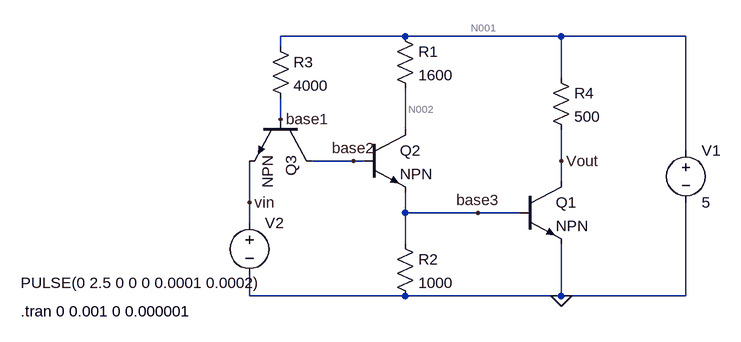
[diagram p0: schematic TTL_NAND_gate.asc]
TTL_NAND_gate.asc, the LTspice schematic file:
Version 4
SHEET 1 880 680
WIRE -736 -528 -928 -528
WIRE -496 -528 -736 -528
WIRE -304 -528 -496 -528
WIRE -928 -512 -928 -528
WIRE -496 -464 -496 -528
WIRE -928 -400 -928 -432
WIRE -736 -384 -736 -448
WIRE -304 -352 -304 -528
WIRE -816 -336 -880 -336
WIRE -800 -336 -816 -336
WIRE -496 -336 -496 -384
WIRE -496 -304 -496 -336
WIRE -976 -272 -976 -336
WIRE -736 -256 -736 -288
WIRE -624 -256 -736 -256
WIRE -560 -256 -624 -256
WIRE -976 -240 -976 -272
WIRE -736 -208 -736 -256
WIRE -976 -128 -976 -160
WIRE -736 -128 -976 -128
WIRE -496 -128 -496 -208
WIRE -496 -128 -736 -128
WIRE -304 -128 -304 -272
WIRE -304 -128 -496 -128
FLAG -496 -128 0
FLAG -496 -336 Vout
FLAG -976 -272 vin
FLAG -816 -336 base2
FLAG -624 -256 base3
FLAG -928 -400 base1
SYMBOL npn -560 -304 R0
SYMATTR InstName Q1
SYMBOL npn -800 -384 R0
SYMATTR InstName Q2
SYMBOL npn -880 -400 R90
SYMATTR InstName Q3
SYMBOL res -752 -544 R0
SYMATTR InstName R1
SYMATTR Value 1600
SYMBOL res -752 -224 R0
SYMATTR InstName R2
SYMATTR Value 1000
SYMBOL res -512 -480 R0
SYMATTR InstName R4
SYMATTR Value 500
SYMBOL voltage -304 -368 R0
WINDOW 123 0 0 Left 2
WINDOW 39 0 0 Left 2
SYMATTR InstName V1
SYMATTR Value 5
SYMBOL voltage -976 -256 R0
WINDOW 3 -352 108 Left 2
WINDOW 123 0 0 Left 2
WINDOW 39 0 0 Left 2
SYMATTR Value PULSE(0 2.5 0 0 0 0.0001 0.0002)
SYMATTR InstName V2
SYMBOL res -944 -528 R0
SYMATTR InstName R3
SYMATTR Value 4000
TEXT -1328 -104 Left 2 !.tran 0 0.001 0 0.000001

The netlist it stands for:
* TTL_NAND_gate.asc
Q1 Vout base3 0 0 NPN
Q2 N002 base2 base3 0 NPN
Q3 base2 base1 vin 0 NPN
R1 N001 N002 1600
R2 base3 0 1000
R4 N001 Vout 500
V1 N001 0 5
V2 vin 0 PULSE(0 2.5 0 0 0 0.0001 0.0002)
R3 N001 base1 4000
.model NPN NPN
.model PNP PNP
.lib standard.bjt
.tran 0 0.001 0 0.000001
.backanno
.end

* Results of the author's LTspice run, read from the files saved beside the schematic
* Operating Point, zero values left out:
*   V(vout) = 5 V
*   V(base3) = 5.018 nV
*   V(n002) = 5 V
*   V(base2) = 17.93 mV
*   V(base1) = 793 mV
*   V(n001) = 5 V
*   Ic(Q3) = 4.964 pA
*   Ib(Q3) = 1.052 mA
*   Ie(Q3) = -1.052 mA
*   Ic(Q2) = 4.982 pA
*   Ib(Q2) = -4.964 pA
*   Ic(Q1) = 5 pA
*   Ib(Q1) = -5 pA
*   I(R3) = 1.052 mA
*   I(R4) = 5 pA
*   I(R2) = 5.018 pA
*   I(R1) = 4.982 pA
*   I(V2) = 1.052 mA
*   I(V1) = -1.052 mA
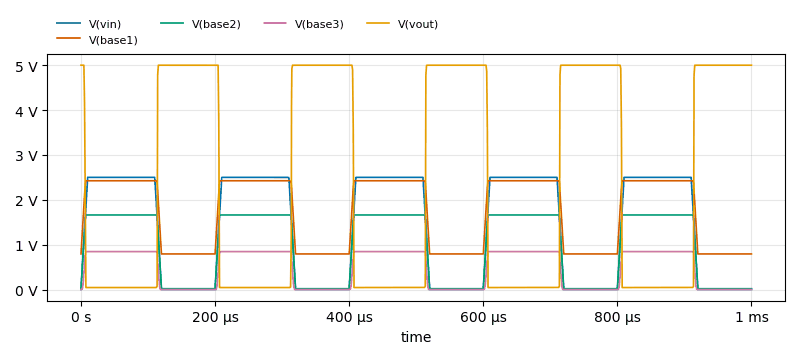
[diagram p1: Transient Analysis of TTL_NAND_gate.asc, plotted from the saved traces]
* Transient Analysis, 1 run:
*   V(vin): min 0 V, max 2.5 V, average 1.375 V, rms 1.826 V, last 0 V
*   V(base1): min 793 mV, max 2.424 V, average 1.718 V, rms 1.891 V, last 793 mV
*   V(base2): min 17.93 mV, max 1.661 V, average 949.6 mV, rms 1.239 V, last 17.93 mV
*   V(base3): min 0 V, max 845.4 mV, average 468.8 mV, rms 625.6 mV, last 0 V
*   V(vout): min 43.93 mV, max 5 V, average 2.33 V, rms 3.388 V, last 5 V